# EasyEDA schematic SCH_ATMEGA328_GAZPAR_rev1.0b.json
TITLE: ATMEGA PULSE NRF24L01; REV: 1.0b; Date: 2024-02-11; Sheet: 1/1; Drawn By: VIBR; Company: VINCENT BESSON
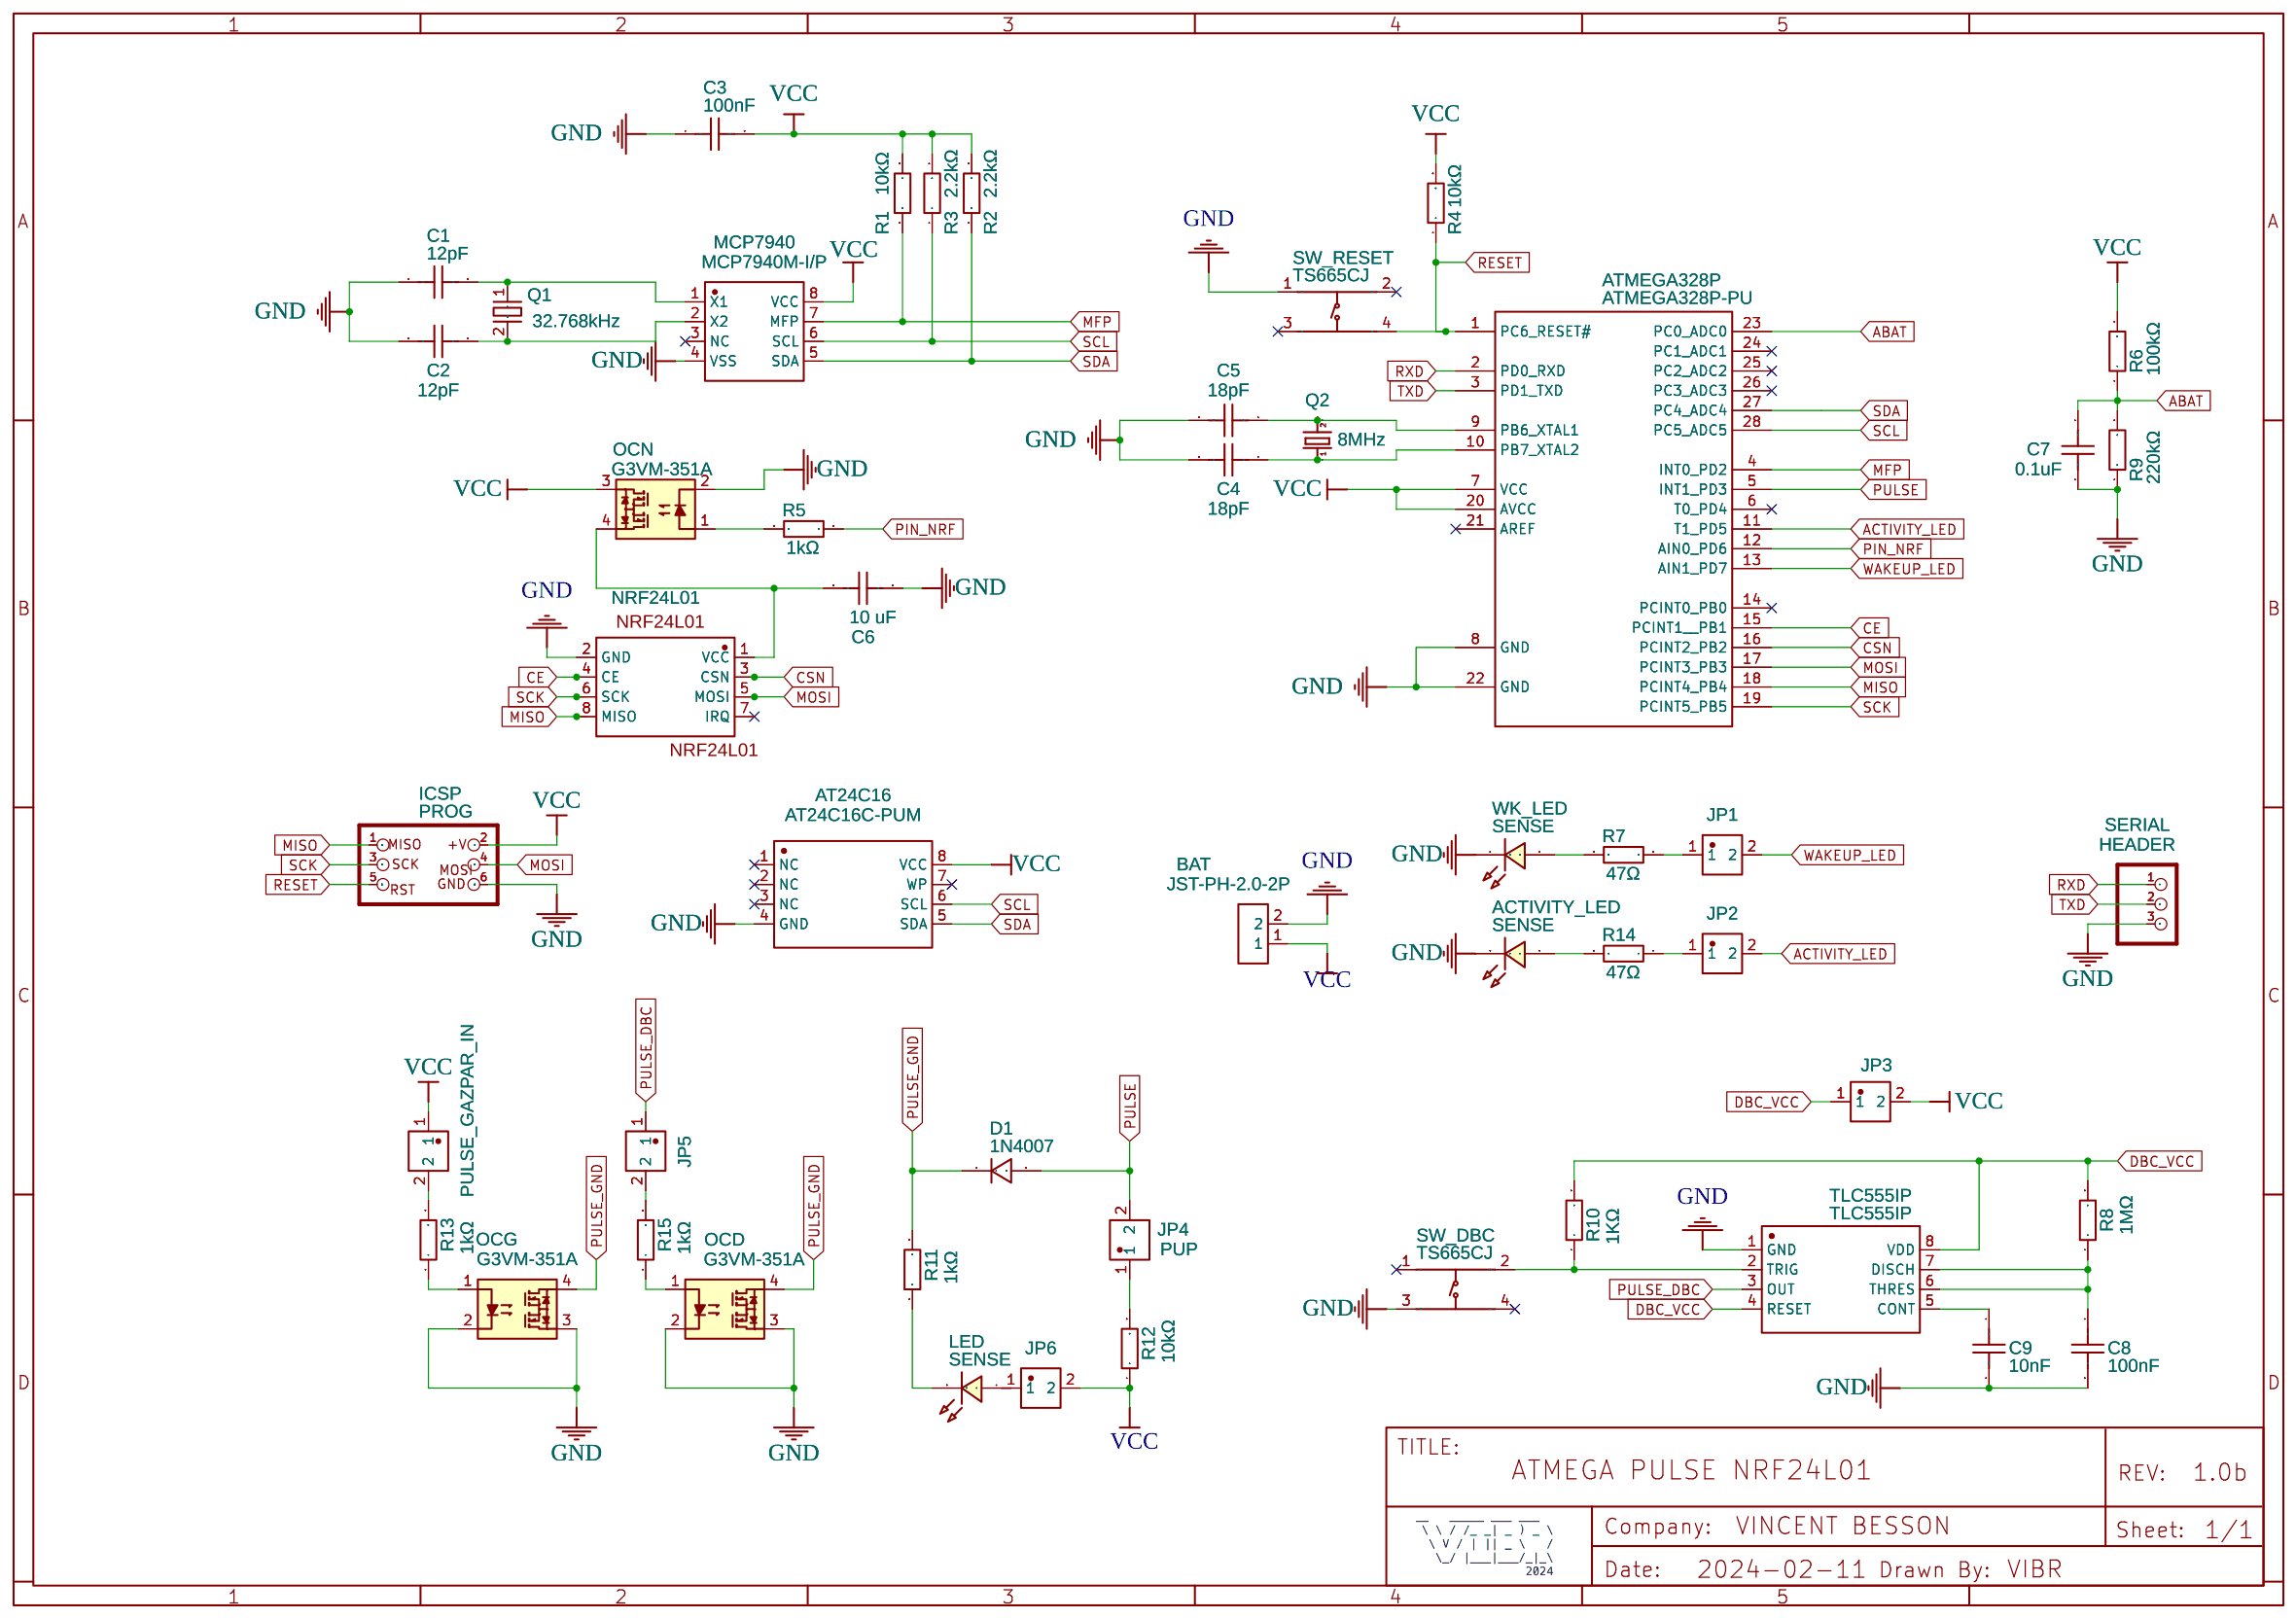
[diagram p0: schematic sheet]

## Parts
ACTIVITY_LED  SENSE  [LED-TH_BD5.0_RED]
AT24C16  AT24C16C-PUM  [DIP-8_L9.7-W6.4-P2.54-LS7.6-BL]
ATMEGA328P  ATMEGA328P-PU  [DIP-28_L34.6-W7.3-P2.54-LS10.2-BL]
BAT  JST-PH-2.0-2P  [JST-PH-2.0-2P]
C1  12pF  [CAP-TH_L5.0-W5.0-P2.54-D1.0]
C2  12pF  [CAP-TH_L5.0-W5.0-P2.54-D1.0]
C3  100nF  [CAP-TH_L5.0-W5.0-P2.54-D1.0]
C4  18pF  [CAP-TH_L5.0-W5.0-P2.54-D1.0]
C5  18pF  [CAP-TH_L5.0-W5.0-P2.54-D1.0]
C6  10 uF  [CAP-TH_L5.0-W5.0-P2.54-D1.0]
C7  0.1uF  [CAP-TH_L5.0-W5.0-P2.54-D1.0]
C8  100nF  [CAP-TH_L5.0-W5.0-P2.54-D1.0]
C9  10nF  [CAP-TH_L5.0-W5.0-P2.54-D1.0]
D1  1N4007  [DO-41_BD2.4-L4.7-P8.70-D0.9-RD]
ICSP  PROG  [HEADER_PRG_2X03]
JP1  GAZPAR  [HDR-TH_2P-P2.54-V-M]
JP2  GAZPAR  [HDR-TH_2P-P2.54-V-M]
JP3  GAZPAR  [HDR-TH_2P-P2.54-V-M]
JP4  PUP  [HDR-TH_2P-P2.54-V-M]
JP5  GAZPAR_PULSE  [HDR-TH_2P-P2.54-V-M]
JP6  JMP_LED  [HDR-TH_2P-P2.54-V-M]
LED  SENSE  [LED-TH_BD5.0_RED]
MCP7940  MCP7940M-I/P  [PDIP-8_L9.3-W6.4-P2.54-LS7.9-BL-1]
NRF24L01  NRF24L01  [NRF24L01]
OCD  G3VM-351A  [DIP-4_W7.62MM]
OCG  G3VM-351A  [DIP-4_W7.62MM]
OCN  G3VM-351A  [DIP-4_W7.62MM]
PULSE_GAZPAR_IN  GAZPAR_PULSE  [HDR-TH_2P-P2.54-V-M]
Q1  32.768kHz  [CRYSTAL-TH_BD2.1-P0.70-D0.3]
Q2  8MHz  [HC49S_1.3DRILL]
R1  10kΩ  [RES-TH_BD2.5-L6.5-P10.50-D0.6]
R2  2.2kΩ  [RES-TH_BD2.5-L6.5-P10.50-D0.6]
R3  2.2kΩ  [RES-TH_BD2.5-L6.5-P10.50-D0.6]
R4  10kΩ  [RES-TH_BD2.5-L6.5-P10.50-D0.6]
R5  1kΩ  [RES-TH_BD2.5-L6.5-P10.50-D0.6]
R6  100kΩ  [RES-TH_BD2.5-L6.5-P10.50-D0.6]
R7  47Ω  [RES-TH_BD2.5-L6.5-P10.50-D0.6]
R8  1MΩ  [RES-TH_BD2.5-L6.5-P10.50-D0.6]
R9  220kΩ  [RES-TH_BD2.5-L6.5-P10.50-D0.6]
R10  1KΩ  [RES-TH_BD2.5-L6.5-P10.50-D0.6]
R11  1kΩ  [RES-TH_BD2.5-L6.5-P10.50-D0.6]
R12  10kΩ  [RES-TH_BD2.5-L6.5-P10.50-D0.6]
R13  1kΩ  [RES-TH_BD2.5-L6.5-P10.50-D0.6]
R14  47Ω  [RES-TH_BD2.5-L6.5-P10.50-D0.6]
R15  1kΩ  [RES-TH_BD2.5-L6.5-P10.50-D0.6]
SERIAL  HEADER  [1X03]
SW_DBC  TS665CJ  [SW-TH_4P-L6.0-W6.0-P4.50-LS6.5]
SW_RESET  TS665CJ  [SW-TH_4P-L6.0-W6.0-P4.50-LS6.5]
TLC555IP  TLC555IP  [DIP-8_L10.1-W6.3-P2.54-LS7.6-BL]
WK_LED  SENSE  [LED-TH_BD5.0_RED]

## Library data of the parts
ACTIVITY_LED LED WK_LED = LED-TH-5mm_R: Manufacturer: EVERLIGHT(台湾亿光); Manufacturer Part: 333-2SURD/S530-A3; Supplier Part: C87271; Supplier: LCSC; Contributor: LCEDA_Lib
AT24C16 = AT24C16C-PUM: Supplier: LCSC; Manufacturer: MICROCHIP(美国微芯); Supplier Part: C8813; JLCPCB Part Class: Extended Part; link: https://lcsc.com/eda_search?q=C8813&%26type=1&ref=editor
ATMEGA328P = ATMEGA328P-PU: sourceId: Oic6oiASL; Contributor: LCSC; Supplier: LCSC; Manufacturer: MICROCHIP(美国微芯); Supplier Part: C33901; JLCPCB Part Class: Extended Part; link: https://lcsc.com/eda_search?q=C33901&%26type=1&ref=editor
BAT = JST-PH-2.0-2P: Contributor: DyneTrex
C1-C9 = CC1H200KA1PDCH4B3003: Contributor: LCSC; Supplier: LCSC; Supplier Part: C353911; Manufacturer: Dersonic(德尔创); JLCPCB Part Class: Extended Part; link: https://lcsc.com/eda_search?q=C353911&%26type=1&ref=editor
D1 = 1N4007: Supplier: LCSC; Manufacturer: SEMTECH; Supplier Part: C106903; Contributor: LCEDA_Lib
ICSP = CON_HEADER_PRG_AVR_ICSP-PTH: 2x3 AVR ICSP programming header; Contributor: DangerousPrototype
JP1-JP6 PULSE_GAZPAR_IN = X6521WV-2X01H-C30D60: Supplier: LCSC; Supplier Part: C2883961; Manufacturer: XKB Connectivity(中国星坤); Manufacturer Part: X6521WV-2x01H-C30D60; link: https://atta.szlcsc.com/upload/public/pdf/source/20211009/DE33EBA4104B5B447A7BD8383FBBA145.pdf; Contributor: LCSC; JLCPCB Part Class: Extended Part
MCP7940 = MCP7940M-I/P: Contributor: lcsc; Supplier: LCSC; Supplier Part: C640451; Manufacturer: MICROCHIP(美国微芯); JLCPCB Part Class: Extended Part; link: https://lcsc.com/eda_search?q=C640451&%26type=1&ref=editor
NRF24L01 = NRF24L01: Contributor: chiragparmar314; Package Display: Yes
OCD OCG = G3VM-351A: Contributor: jff011
OCN = G3VM-351A: Contributor: jff011; Package Display: No
Q1 = AB26T-32.768KHZ: Contributor: lcsc; Supplier: LCSC; Supplier Part: C568378; Manufacturer: ABRACON; JLCPCB Part Class: Extended Part; link: https://lcsc.com/eda_search?q=C568378&%26type=1&ref=editor
Q2 = HC49/S1.3: Contributor: 陳威廷
R1-R15 = MFR0W4F1002A50: Supplier: LCSC; Manufacturer: UNI-ROYAL(厚声); Supplier Part: C57436; JLCPCB Part Class: Extended Part; link: https://lcsc.com/eda_search?q=C57436&%26type=1&ref=editor
SERIAL = PINHD-1X3: Contributor: Adafruit
SW_DBC SW_RESET = TS665CJ: Contributor: LCSC; Supplier: LCSC; Supplier Part: C393938; Manufacturer: SHOU HAN(首韩); JLCPCB Part Class: Extended Part
TLC555IP = TLC555IP: Contributor: lcsc; Supplier: LCSC; Supplier Part: C1520182; Manufacturer: TI(德州仪器); JLCPCB Part Class: Extended Part

## Nets
GND: ACTIVITY_LED.2 AT24C16.4(GND) ATMEGA328P.8(GND) ATMEGA328P.22(GND) BAT.2 C1.1 C2.2 C3.1 C4.2 C5.2 C6.2 C7.2 C8.2 C9.2 ICSP.6(GND) MCP7940.4(VSS) NRF24L01.2(GND) OCD.2 OCD.3 OCG.2 OCG.3 OCN.2 R9.1 SERIAL.3 SW_DBC.3(C) SW_RESET.1(A) TLC555IP.1(GND) WK_LED.2
VCC: AT24C16.8(VCC) ATMEGA328P.7(VCC) ATMEGA328P.20(AVCC) BAT.1 C3.2 ICSP.2(+V) JP3.2 JP6.2 MCP7940.8(VCC) OCN.3 PULSE_GAZPAR_IN.1 R1.2 R2.2 R3.2 R4.2 R6.2 R12.1
ABAT: ATMEGA328P.23(PC0 ADC0) C7.1 R6.1 R9.2
ACTIVITY_LED: ATMEGA328P.11(T1 PD5) JP2.2
CE: ATMEGA328P.15(PCINT1  PB1) NRF24L01.4(CE)
CSN: ATMEGA328P.16(PCINT2 PB2) NRF24L01.3(CSN)
DBC_VCC: JP3.1 R8.2 R10.2 TLC555IP.4(RESET) TLC555IP.8(VDD)
MFP: ATMEGA328P.4(INT0 PD2) MCP7940.7(MFP) R1.1
MISO: ATMEGA328P.18(PCINT4 PB4) ICSP.1(MISO) NRF24L01.8(MISO)
MOSI: ATMEGA328P.17(PCINT3 PB3) ICSP.4(MOSI) NRF24L01.5(MOSI)
PIN_NRF: ATMEGA328P.12(AIN0 PD6) R5.1
PULSE: ATMEGA328P.5(INT1 PD3) D1.2 JP4.2
PULSE_DBC: JP5.1 TLC555IP.3(OUT)
PULSE_GND: D1.1 OCD.4 OCG.4 R11.2
RESET: ATMEGA328P.1(PC6 RESET#) ICSP.5(RST) R4.1 SW_RESET.4(D)
RXD: ATMEGA328P.2(PD0 RXD) SERIAL.1
SCK: ATMEGA328P.19(PCINT5 PB5) ICSP.3(SCK) NRF24L01.6(SCK)
SCL: AT24C16.6(SCL) ATMEGA328P.28(PC5 ADC5) MCP7940.6(SCL) R3.1
SDA: AT24C16.5(SDA) ATMEGA328P.27(PC4 ADC4) MCP7940.5(SDA) R2.1
TXD: ATMEGA328P.3(PD1 TXD) SERIAL.2
WAKEUP_LED: ATMEGA328P.13(AIN1 PD7) JP1.2
Net-(ACTIVITY_LED-1): ACTIVITY_LED.1 R14.2
Net-(ATMEGA328P-9): ATMEGA328P.9(PB6 XTAL1) C5.1 Q2.2
Net-(ATMEGA328P-10): ATMEGA328P.10(PB7 XTAL2) C4.1 Q2.1
Net-(C1-2): C1.2 MCP7940.1(X1) Q1.1
Net-(C2-1): C2.1 MCP7940.2(X2) Q1.2(GND)
Net-(C6-1): C6.1 NRF24L01.1(VCC) OCN.4
Net-(C8-1): C8.1 R8.1 TLC555IP.6(THRES) TLC555IP.7(DISCH)
Net-(C9-1): C9.1 TLC555IP.5(CONT)
Net-(JP1-1): JP1.1 R7.1
Net-(JP2-1): JP2.1 R14.1
Net-(JP4-1): JP4.1 R12.2
Net-(JP5-2): JP5.2 R15.2
Net-(JP6-1): JP6.1 LED.1
Net-(LED-2): LED.2 R11.1
Net-(OCD-1): OCD.1 R15.1
Net-(OCG-1): OCG.1 R13.1
Net-(OCN-1): OCN.1 R5.2
Net-(PULSE_GAZPAR_IN-2): PULSE_GAZPAR_IN.2 R13.2
Net-(R7-2): R7.2 WK_LED.1
Net-(R10-1): R10.1 SW_DBC.2(B) TLC555IP.2(TRIG)

Not connected (* = marked no-connect by the designer): AT24C16 1(NC)* 2(NC)* 3(NC)* 7(WP)*; ATMEGA328P 6(T0 PD4)* 14(PCINT0 PB0)* 21(AREF)* 24(PC1 ADC1)* 25(PC2 ADC2)* 26(PC3 ADC3)*; MCP7940 3(NC)*; NRF24L01 7(IRQ)*; SW_DBC 1(A)* 4(D)*; SW_RESET 2(B)* 3(C)*
